# Altium schematic sheet eps_bt1.SchDoc
size A; SheetNumber: 6; SheetTotal: 19
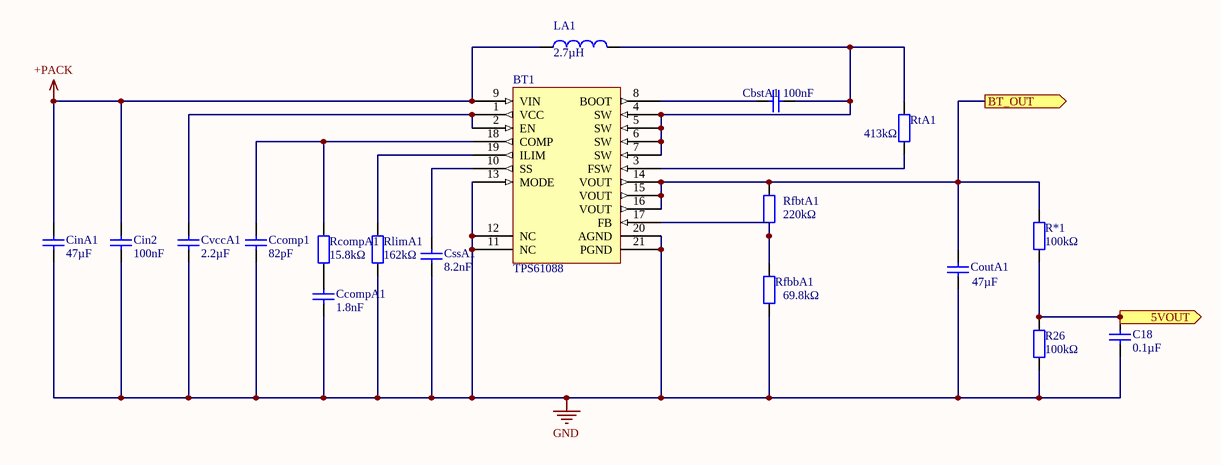
[diagram p0: eps_bt1.SchDoc]

## Parts
BT1  TPS61088  [QFN50P450X350X100-21N]
C18  0.1µF  [1608[0603]]
CbstA1  100nF  [1608[0603]]
Ccomp1  82pF  [1608[0603]]
CcompA1  1.8nF  [1608[0603]]
Cin2  100nF  [1608[0603]]
CinA1  47µF  [1608[0603]]
CoutA1  47µF  [1608[0603]]
CssA1  8.2nF  [1608[0603]]
CvccA1  2.2µF  [1608[0603]]
LA1  2.7µH  [1608[0603]]
R26  100kΩ  [1608[0603]]
R*1  100kΩ  [1608[0603]]
RcompA1  15.8kΩ  [1608[0603]]
RfbbA1  69.8kΩ  [1608[0603]]
RfbtA1  220kΩ  [1608[0603]]
RlimA1  162kΩ  [1608[0603]]
RtA1  413kΩ  [1608[0603]]

## Ports
5VOUT (out), BT_OUT (out)

## Nets
+PACK: BT1.9(VIN) Cin2.2 CinA1.2 LA1.1
GND: BT1.11(NC) BT1.12(NC) BT1.13(MODE) BT1.20(AGND) BT1.21(PGND) C18.2 Ccomp1.1 CcompA1.1 Cin2.1 CinA1.1 CoutA1.1 CssA1.1 CvccA1.1 R26.1 RfbbA1.1 RlimA1.1
5VOUT: C18.1 R26.2 R*1.1 ; port 5VOUT
BT_OUT: BT1.14(VOUT) BT1.15(VOUT) BT1.16(VOUT) CoutA1.2 R*1.2 RfbtA1.2 ; port BT_OUT
NetBT1_1: BT1.1(VCC) BT1.2(EN) CvccA1.2
NetBT1_3: BT1.3(FSW) RtA1.2
NetBT1_4: BT1.4(SW) BT1.5(SW) BT1.6(SW) BT1.7(SW) CbstA1.1 LA1.2 RtA1.1
NetBT1_8: BT1.8(BOOT) CbstA1.2
NetBT1_10: BT1.10(SS) CssA1.2
NetBT1_17: BT1.17(FB) RfbbA1.2 RfbtA1.1
NetBT1_18: BT1.18(COMP) Ccomp1.2 RcompA1.2
NetBT1_19: BT1.19(ILIM) RlimA1.2
NetCcompA1_2: CcompA1.2 RcompA1.1

## Library data of the parts
BT1 = TPS61088: Boost converter
C18 CbstA1 Ccomp1 CcompA1 Cin2 CinA1 CoutA1 CssA1 CvccA1 = Cap: Capacitor; Published: 8-Jun-2000; LatestRevisionDate: 17-Jul-2002; LatestRevisionNote: Re-released for DXP Platform.; PackageReference: RAD-0.3; Publisher: Altium Limited; PackageDescription: Radial Cap, Thru-Hole; 2 Leads; 0.3 in Pin Spacing
  C18: Value: 0.1µF
  CbstA1 Cin2: Value: 100nF
  Ccomp1: Value: 82pF
  CcompA1: Value: 1.8nF
  CinA1 CoutA1: Value: 47µF
  CssA1: Value: 8.2nF
  CvccA1: Value: 2.2µF
LA1 = Inductor: Code_IEC: 1005; Published: 8-Jun-2000; LatestRevisionDate: 29-May-2009; LatestRevisionNote: IPC-7351 Footprint Added.; PackageReference: 0402-A; Publisher: Altium Limited; PackageDescription: Chip Inductor; Code_JEITA: 0402; Value: 2.7µH
R26 R*1 RcompA1 RfbbA1 RfbtA1 RlimA1 RtA1 = Res2: Resistor; Published: 8-Jun-2000; LatestRevisionDate: 17-Jul-2002; LatestRevisionNote: Re-released for DXP Platform.; PackageReference: AXIAL-0.4; Publisher: Altium Limited; PackageDescription: Axial Device, Thru-Hole; 2 Leads; 0.4 in Pin Spacing
  R26 R*1: Value: 100kΩ
  RcompA1: Value: 15.8kΩ
  RfbbA1: Value: 69.8kΩ
  RfbtA1: Value: 220kΩ
  RlimA1: Value: 162kΩ
  RtA1: Value: 413kΩ